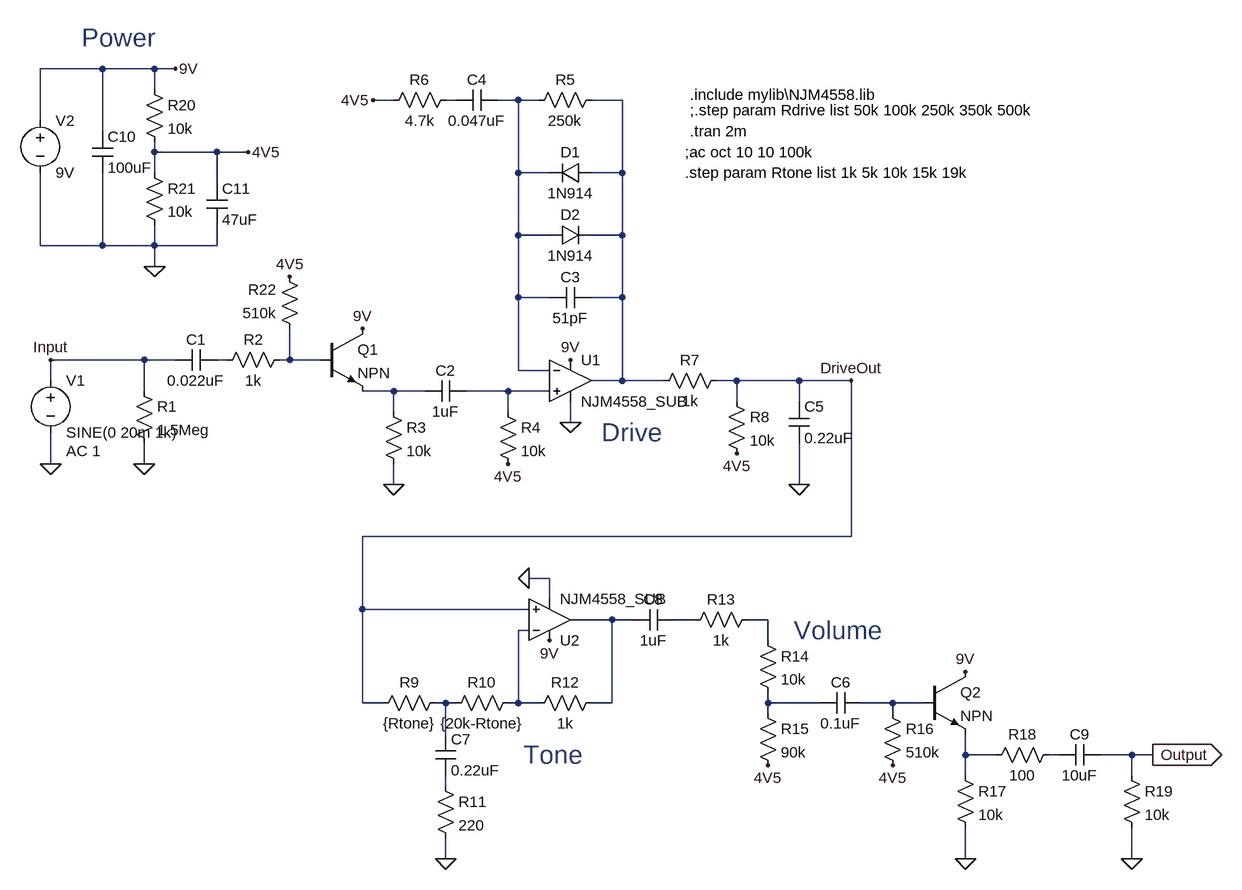
[diagram p0: schematic Tube_Screamer_808.asc]
Tube_Screamer_808.asc, the LTspice schematic file:
Version 4
SHEET 1 2708 928
WIRE 192 -336 96 -336
WIRE 272 -336 192 -336
WIRE 304 -336 272 -336
WIRE 272 -304 272 -336
WIRE 640 -288 608 -288
WIRE 736 -288 720 -288
WIRE 832 -288 800 -288
WIRE 864 -288 832 -288
WIRE 992 -288 944 -288
WIRE 96 -256 96 -336
WIRE 192 -240 192 -336
WIRE 272 -208 272 -224
WIRE 368 -208 272 -208
WIRE 416 -208 368 -208
WIRE 272 -176 272 -208
WIRE 832 -176 832 -288
WIRE 880 -176 832 -176
WIRE 992 -176 992 -288
WIRE 992 -176 944 -176
WIRE 368 -160 368 -208
WIRE 832 -80 832 -176
WIRE 880 -80 832 -80
WIRE 992 -80 992 -176
WIRE 992 -80 944 -80
WIRE 96 -64 96 -176
WIRE 192 -64 192 -176
WIRE 192 -64 96 -64
WIRE 272 -64 272 -96
WIRE 272 -64 192 -64
WIRE 368 -64 368 -96
WIRE 368 -64 272 -64
WIRE 272 -32 272 -64
WIRE 832 16 832 -80
WIRE 880 16 832 16
WIRE 992 16 992 -80
WIRE 992 16 944 16
WIRE 256 112 112 112
WIRE 304 112 256 112
WIRE 384 112 368 112
WIRE 480 112 480 64
WIRE 480 112 464 112
WIRE 528 112 480 112
WIRE 832 128 832 16
WIRE 880 128 832 128
WIRE 112 144 112 112
WIRE 992 144 992 16
WIRE 992 144 944 144
WIRE 1056 144 992 144
WIRE 1168 144 1136 144
WIRE 1264 144 1168 144
WIRE 1344 144 1264 144
WIRE 256 160 256 112
WIRE 640 160 592 160
WIRE 688 160 640 160
WIRE 816 160 752 160
WIRE 880 160 816 160
WIRE 1168 176 1168 144
WIRE 1264 176 1264 144
WIRE 640 192 640 160
WIRE 816 192 816 160
WIRE 912 208 912 176
WIRE 112 272 112 224
WIRE 256 272 256 240
WIRE 640 304 640 272
WIRE 1264 304 1264 240
WIRE 1344 384 1344 144
WIRE 1344 384 592 384
WIRE 880 448 848 448
WIRE 880 480 880 448
WIRE 592 496 592 384
WIRE 848 496 592 496
WIRE 976 512 912 512
WIRE 1008 512 976 512
WIRE 1104 512 1072 512
WIRE 1216 512 1184 512
WIRE 848 528 832 528
WIRE 1216 544 1216 512
WIRE 592 640 592 496
WIRE 624 640 592 640
WIRE 720 640 704 640
WIRE 736 640 720 640
WIRE 832 640 832 528
WIRE 832 640 816 640
WIRE 864 640 832 640
WIRE 976 640 976 512
WIRE 976 640 944 640
WIRE 1216 640 1216 624
WIRE 1296 640 1216 640
WIRE 1408 640 1360 640
WIRE 1456 640 1408 640
WIRE 1216 656 1216 640
WIRE 1408 656 1408 640
WIRE 720 688 720 640
WIRE 1520 720 1520 688
WIRE 1568 720 1520 720
WIRE 1664 720 1648 720
WIRE 1776 720 1728 720
WIRE 1808 720 1776 720
WIRE 1520 752 1520 720
WIRE 1776 752 1776 720
WIRE 720 768 720 752
WIRE 720 880 720 848
WIRE 1520 880 1520 832
WIRE 1776 880 1776 832
FLAG 112 272 0
FLAG 256 272 0
FLAG 640 304 0
FLAG 912 208 0
FLAG 816 272 4V5
FLAG 592 64 9V
FLAG 912 112 9V
FLAG 1168 256 4V5
FLAG 1264 304 0
FLAG 720 880 0
FLAG 1216 736 4V5
FLAG 1520 880 0
FLAG 1520 592 9V
FLAG 1408 736 4V5
FLAG 1776 880 0
FLAG 1808 720 Output
IOPIN 1808 720 Out
FLAG 416 -208 4V5
FLAG 272 -32 0
FLAG 304 -336 9V
FLAG 480 -16 4V5
FLAG 112 112 Input
FLAG 1344 144 DriveOut
FLAG 608 -288 4V5
FLAG 880 544 9V
FLAG 848 448 0
SYMBOL voltage 112 128 R0
WINDOW 123 24 124 Left 2
WINDOW 39 0 0 Left 2
SYMATTR Value2 AC 1
SYMATTR InstName V1
SYMATTR Value SINE(0 20m 1k)
SYMBOL res 240 144 R0
SYMATTR InstName R1
SYMATTR Value 1.5Meg
SYMBOL cap 368 96 R90
WINDOW 0 0 32 VBottom 2
WINDOW 3 32 32 VTop 2
SYMATTR InstName C1
SYMATTR Value 0.022uF
SYMBOL res 480 96 R90
WINDOW 0 0 56 VBottom 2
WINDOW 3 32 56 VTop 2
SYMATTR InstName R2
SYMATTR Value 1k
SYMBOL npn 528 64 R0
SYMATTR InstName Q1
SYMBOL res 624 176 R0
SYMATTR InstName R3
SYMATTR Value 10k
SYMBOL cap 752 144 R90
WINDOW 0 0 32 VBottom 2
WINDOW 3 32 32 VTop 2
SYMATTR InstName C2
SYMATTR Value 1uF
SYMBOL res 800 176 R0
SYMATTR InstName R4
SYMATTR Value 10k
SYMBOL Opamps\\opamp2 912 80 R0
SYMATTR InstName U1
SYMATTR Value NJM4558_SUB
SYMBOL cap 944 0 R90
WINDOW 0 0 32 VBottom 2
WINDOW 3 32 32 VTop 2
SYMATTR InstName C3
SYMATTR Value 51pF
SYMBOL diode 944 -160 M270
WINDOW 0 32 32 VTop 2
WINDOW 3 0 32 VBottom 2
SYMATTR InstName D1
SYMATTR Value 1N914
SYMBOL diode 880 -64 R270
WINDOW 0 32 32 VTop 2
WINDOW 3 0 32 VBottom 2
SYMATTR InstName D2
SYMATTR Value 1N914
SYMBOL res 960 -304 R90
WINDOW 0 0 56 VBottom 2
WINDOW 3 32 56 VTop 2
SYMATTR InstName R5
SYMATTR Value 250k
SYMBOL cap 800 -304 R90
WINDOW 0 0 32 VBottom 2
WINDOW 3 32 32 VTop 2
SYMATTR InstName C4
SYMATTR Value 0.047uF
SYMBOL res 736 -304 R90
WINDOW 0 0 56 VBottom 2
WINDOW 3 32 56 VTop 2
SYMATTR InstName R6
SYMATTR Value 4.7k
SYMBOL res 1152 128 R90
WINDOW 0 0 56 VBottom 2
WINDOW 3 32 56 VTop 2
SYMATTR InstName R7
SYMATTR Value 1k
SYMBOL res 1152 160 R0
SYMATTR InstName R8
SYMATTR Value 10k
SYMBOL cap 1248 176 R0
SYMATTR InstName C5
SYMATTR Value 0.22uF
SYMBOL Opamps\\opamp2 880 576 M180
SYMATTR InstName U2
SYMATTR Value NJM4558_SUB
SYMBOL res 720 624 R90
WINDOW 0 0 56 VBottom 2
WINDOW 3 32 56 VTop 2
SYMATTR InstName R9
SYMATTR Value {Rtone}
SYMBOL res 832 624 R90
WINDOW 0 0 56 VBottom 2
WINDOW 3 32 56 VTop 2
SYMATTR InstName R10
SYMATTR Value {20k-Rtone}
SYMBOL cap 704 688 R0
SYMATTR InstName C7
SYMATTR Value 0.22uF
SYMBOL res 704 752 R0
SYMATTR InstName R11
SYMATTR Value 220
SYMBOL res 960 624 R90
WINDOW 0 0 56 VBottom 2
WINDOW 3 32 56 VTop 2
SYMATTR InstName R12
SYMATTR Value 1k
SYMBOL cap 1072 496 R90
WINDOW 0 0 32 VBottom 2
WINDOW 3 32 32 VTop 2
SYMATTR InstName C8
SYMATTR Value 1uF
SYMBOL res 1200 496 R90
WINDOW 0 0 56 VBottom 2
WINDOW 3 32 56 VTop 2
SYMATTR InstName R13
SYMATTR Value 1k
SYMBOL res 1200 528 R0
SYMATTR InstName R14
SYMATTR Value 10k
SYMBOL res 1200 640 R0
SYMATTR InstName R15
SYMATTR Value 90k
SYMBOL cap 1360 624 R90
WINDOW 0 0 32 VBottom 2
WINDOW 3 32 32 VTop 2
SYMATTR InstName C6
SYMATTR Value 0.1uF
SYMBOL res 1392 640 R0
SYMATTR InstName R16
SYMATTR Value 510k
SYMBOL npn 1456 592 R0
SYMATTR InstName Q2
SYMBOL res 1504 736 R0
SYMATTR InstName R17
SYMATTR Value 10k
SYMBOL res 1664 704 R90
WINDOW 0 0 56 VBottom 2
WINDOW 3 32 56 VTop 2
SYMATTR InstName R18
SYMATTR Value 100
SYMBOL cap 1728 704 R90
WINDOW 0 0 32 VBottom 2
WINDOW 3 32 32 VTop 2
SYMATTR InstName C9
SYMATTR Value 10uF
SYMBOL res 1760 736 R0
SYMATTR InstName R19
SYMATTR Value 10k
SYMBOL voltage 96 -272 R0
WINDOW 123 0 0 Left 2
WINDOW 39 0 0 Left 2
SYMATTR InstName V2
SYMATTR Value 9V
SYMBOL res 256 -320 R0
SYMATTR InstName R20
SYMATTR Value 10k
SYMBOL res 256 -192 R0
SYMATTR InstName R21
SYMATTR Value 10k
SYMBOL res 496 80 R180
WINDOW 0 36 76 Left 2
WINDOW 3 36 40 Left 2
SYMATTR InstName R22
SYMATTR Value 510k
SYMBOL cap 176 -240 R0
SYMATTR InstName C10
SYMATTR Value 100uF
SYMBOL cap 352 -160 R0
SYMATTR InstName C11
SYMATTR Value 47uF
TEXT 960 224 Left 4 ;Drive
TEXT 840 720 Left 4 ;Tone
TEXT 1256 528 Left 4 ;Volume
TEXT 160 -384 Left 4 ;Power
TEXT 1096 -296 Left 2 !.include mylib\\NJM4558.lib
TEXT 1096 -272 Left 2 !;.step param Rdrive list 50k 100k 250k 350k 500k
TEXT 1096 -240 Left 2 !.tran 2m
TEXT 1088 -208 Left 2 !;ac oct 10 10 100k
TEXT 1088 -176 Left 2 !.step param Rtone list 1k 5k 10k 15k 19k

The netlist it stands for:
* Tube_Screamer_808.asc
V1 Input 0 SINE(0 20m 1k) AC 1
R1 Input 0 1.5Meg
C1 N004 Input 0.022uF
R2 N005 N004 1k
Q1 9V N005 N006 0 NPN
R3 N006 0 10k
C2 N007 N006 1uF
R4 N007 4V5 10k
XU1 N007 N002 9V 0 N003 NJM4558_SUB  ; pins In+ In- V+ V- OUT
C3 N003 N002 51pF
D1 N003 N002 1N914
D2 N002 N003 1N914
R5 N003 N002 250k
C4 N002 N001 0.047uF
R6 N001 4V5 4.7k
R7 DriveOut N003 1k
R8 DriveOut 4V5 10k
C5 DriveOut 0 0.22uF
XU2 DriveOut N011 9V 0 N008 NJM4558_SUB  ; pins In+ In- V+ V- OUT
R9 N012 DriveOut {Rtone}
R10 N011 N012 {20k-Rtone}
C7 N012 N017 0.22uF
R11 N017 0 220
R12 N008 N011 1k
C8 N009 N008 1uF
R13 N010 N009 1k
R14 N010 N013 10k
R15 N013 4V5 90k
C6 N014 N013 0.1uF
R16 N014 4V5 510k
Q2 9V N014 N015 0 NPN
R17 N015 0 10k
R18 N016 N015 100
C9 Output N016 10uF
R19 Output 0 10k
V2 9V 0 9V
R20 9V 4V5 10k
R21 4V5 0 10k
R22 N005 4V5 510k
C10 9V 0 100uF
C11 4V5 0 47uF
.model D D
.lib standard.dio
.model NPN NPN
.model PNP PNP
.lib standard.bjt
* Drive
* Tone
* Volume
* Power
.include mylib\NJM4558.lib
;.step param Rdrive list 50k 100k 250k 350k 500k
.tran 2m
;ac oct 10 10 100k
.step param Rtone list 1k 5k 10k 15k 19k
.backanno
.end